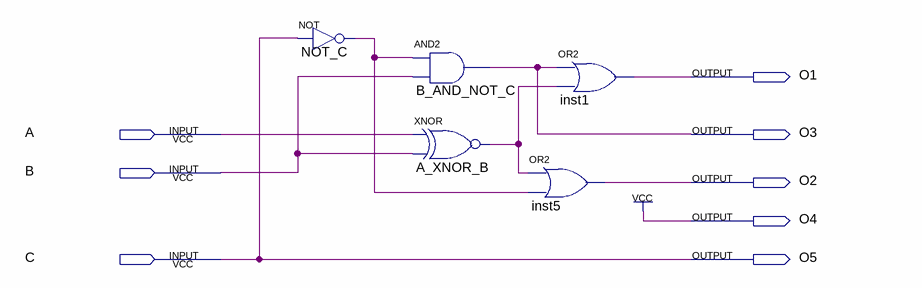
[diagram p0: schematic sheet]
// Quartus schematic Question3.bdf as structural Verilog: 5 symbols, 8 pins
module Question3 (
  input  A,
  input  B,
  input  C,
  output O1,
  output O3,
  output O2,
  output O4,
  output O5
);

  wire A_XNOR_B_out, NOT_C_out;

  not NOT_C (NOT_C_out, C);
  and B_AND_NOT_C (O3, NOT_C_out, B);
  xnor A_XNOR_B (A_XNOR_B_out, A, B);
  or inst1 (O1, O3, A_XNOR_B_out);
  or inst5 (O2, A_XNOR_B_out, NOT_C_out);

  assign O4 = 1'b1;
  assign O5 = C;
endmodule
